# Altium schematic sheet OSC.SchDoc
size Letter; DrawnBy: Titan Yuan; SheetNumber: 7; SheetTotal: 9
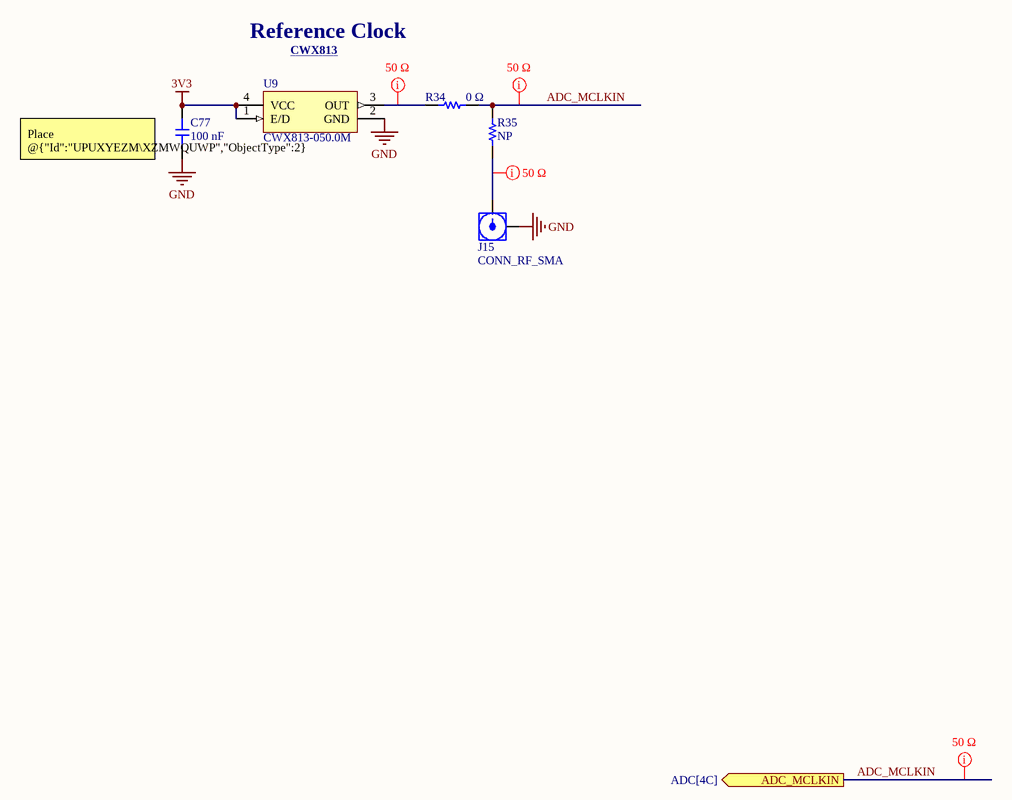
[diagram p0: OSC.SchDoc]

## Parts
C77  100 nF  [CAP_0402]
J15  CONN_RF_SMA  [142-0701-801]
R34  0 Ω  [RES_0402]
R35  NP  [RES_0402]
U9  CWX813-050.0M  [CWX8XX]

## Ports
ADC_MCLKIN (out, see ADC[4C])

## Nets
3V3: C77.2 U9.1(E/D) U9.4(VCC)
GND: C77.1 J15.2 U9.2(GND)
ADC_MCLKIN: R34.2 R35.2 ; port ADC_MCLKIN
NetJ15_1: J15.1 R35.1
NetR34_1: R34.1 U9.3(OUT)

## Layout directives
net class 50 Ω: ADC_MCLKIN, NetJ15_1, NetR34_1

## Notes on the sheet
- Reference Clock
- (near U9) CWX813 <https://www.conwin.com/datasheets/sm/sm111.pdf>
- (near C77) Place @{"Id":"UPUXYEZM\XZMWQUWP","ObjectType":2} right next to pin 2 of @{"Id":"UPUXYEZM\QIVNDBVN","ObjectType":2}.

## Library data of the parts
C77 = CAP: Ceramic Capacitor, Ceramic, 50V, 10% +Tol, 10% -Tol, X7R, 15% TC, 0.1uF, Surface Mount, 0402; Manufacturer: Yageo; Manufacturer Part Number: CC0402KPX7R9BB104; Tolerance: +-10%; Value: 100nF; Voltage Rating: 50 V; Dielectric: Ceramic; Package Size: 0402; Supplier: DigiKey; Supplier Part Number: 13-CC0402KPX7R9BB104CT-ND; RoHS: Compliant; Category: Ceramic Capacitors; Stock: 40680; Pricing: 1=0.1, 10=0.053, 50=0.0364, 100=0.0313, 500=0.02292, 1000=0.02035, 2500=0.01764, 5000=0.01601 (USD); Case/Package: 0402; China RoHS: Compliant; Dielectric Material: Ceramic; Height: 500µm; Lead Free: Lead Free; Length: 1mm; Lifecycle Status: Production; Max Operating Temperature: 125°C; Min Operating Temperature: -55°C; Mounting Technology: Surface Mount; Number of Terminals: 2; REACH SVHC: Yes; Voltage Rating (DC): 50V; Width: 500µm; ComponentLink1URL: https://datasheet.octopart.com:443/CC0402KPX7R9BB104-Yageo-datasheet-177165144.pdf?src-supplier=IHS; ComponentLink1Description: https://datasheet.octopart.com:443/CC0402KPX7R9BB104-Yageo-datasheet-177165144.pdf?src-supplier=IHS; ComponentLink2URL: https://datasheet.octopart.com:443/CC0402KPX7R9BB104-Yageo-Group-datasheet-189192896.pdf?src-supplier=Future+Electronics; ComponentLink2Description: https://datasheet.octopart.com:443/CC0402KPX7R9BB104-Yageo-Group-datasheet-189192896.pdf?src-supplier=Future+Electronics; ComponentLink3URL: https://datasheet.octopart.com:443/CC0402KPX7R9BB104-Yageo-datasheet-181967134.pdf?src-supplier=Farnell; ComponentLink3Description: https://datasheet.octopart.com:443/CC0402KPX7R9BB104-Yageo-datasheet-181967134.pdf?src-supplier=Farnell; ComponentLink4URL: https://datasheet.octopart.com/Surface-Mount-Ceramic-Multilayer-Capacitors%3B-General-Purpose-%26-High-Capacitance-Class-2%2C-X7R-Yageo-datasheet-family-114.pdf; ComponentLink4Description: https://datasheet.octopart.com/Surface-Mount-Ceramic-Multilayer-Capacitors%3B-General-Purpose-%26-High-Capacitance-Class-2%2C-X7R-Yageo-datasheet-family-114.pdf; ComponentLink5URL: https://datasheet.octopart.com/CC0402KPX7R9BB104-Yageo-datasheet-10883670.pdf; ComponentLink5Description: https://datasheet.octopart.com/CC0402KPX7R9BB104-Yageo-datasheet-10883670.pdf; ComponentLink6URL: http://sigma.octopart.com:80/rohs_statement/Surface-Mount-Ceramic-Multilayer-Capacitors%3B-General-Purpose-%26-High-Capacitance-Class-2%2C-X7R-Yageo-family-124.pdf?src-supplier=Compliance+Statements; ComponentLink6Description: http://sigma.octopart.com:80/rohs_statement/Surface-Mount-Ceramic-Multilayer-Capacitors%3B-General-Purpose-%26-High-Capacitance-Class-2%2C-X7R-Yageo-family-124.pdf?src-supplier=Compliance+Statements; ComponentLink7URL: http://sigma.octopart.com:80/reach_statement/Surface-Mount-Ceramic-Multilayer-Capacitors%3B-General-Purpose-%26-High-Capacitance-Class-2%2C-X7R-Yageo-family-125.pdf?src-supplier=Compliance+Statements; ComponentLink7Description: http://sigma.octopart.com:80/reach_statement/Surface-Mount-Ceramic-Multilayer-Capacitors%3B-General-Purpose-%26-High-Capacitance-Class-2%2C-X7R-Yageo-family-125.pdf?src-supplier=Compliance+Statements; ComponentLink8URL: http://sigma.octopart.com:80/conflict_mineral_statement/Yageo-company-3.pdf?src-supplier=Compliance+Statements; ComponentLink8Description: http://sigma.octopart.com:80/conflict_mineral_statement/Yageo-company-3.pdf?src-supplier=Compliance+Statements; ComponentLink9URL: http://sigma.octopart.com:80/rohs_statement/Yageo-company-2.pdf?src-supplier=Compliance+Statements; ComponentLink9Description: http://sigma.octopart.com:80/rohs_statement/Yageo-company-2.pdf?src-supplier=Compliance+Statements
J15 = CONN_RF_SMA: RF / Coaxial Connector, SMA Coaxial, Straight Jack, Solder, 50 ohm, Beryllium Copper; Manufacturer: Cinch Connectivity Solutions Johnson; Maximum Frequency: 18 GHz; Body Material: Brass; Body Plating: Gold; Connector Type: Coaxial, PCB, SMA, Socket; Contact Resistance: 4mΩ; Dielectric Material: PTFE; Frequency: 18GHz; Gender: Female; Impedance: 50Ω; Insulation Resistance: 5GΩ; Number of Contacts: 1; Polarity: Normal; Voltage Rating: 335V; Manufacturer Part Number: 142-0701-801; Supplier: DigiKey; Supplier Part Number: J502-ND; RoHS: Compliant; Category: RF / Coaxial Connectors; Stock: 35108; Pricing: 1=3.73, 10=3.166, 25=2.9676, 50=2.826, 100=2.691, 250=2.52244, 500=2.40206, 1000=2.28748, 2500=2.1444 (USD); Case/Package: SMA; Contact Gender: Female; Contact Material: Gold, Nickel; Contact Plating: Gold; Depth: 25.58mm; Export Control Classification Number (ECCN) Code: EAR99; Fastening Type: Threaded; Height: 9.779mm; Housing Color: Gold; Housing Material: Brass; Harmonized Tariff Schedule (HTS) Code: 8536.69.40.10; Insulation Material: PTFE; Introduction Date: 1994-06-01; Lead Free: Lead Free; Length: 9.52mm; Lifecycle Status: Production; Clock Frequency: 18GHz; Max Operating Temperature: 165°C; Min Operating Temperature: -65°C; Mounting Technology: Edge, PCB; Pins: 1; Number of Ports: 1; Orientation: Straight; Radiation Hardening: No; REACH SVHC: No; Schedule B: 8536695050, 8536695050|8536695050|8536695050|8536695050|8536695050; Shell Material: Brass; Termination: Solder; ComponentLink1URL: https://datasheet.octopart.com:443/142-0701-801-Cinch-Connectors-datasheet-38159423.pdf?src-supplier=element14+APAC; ComponentLink1Description: https://datasheet.octopart.com:443/142-0701-801-Cinch-Connectors-datasheet-38159423.pdf?src-supplier=element14+APAC; ComponentLink2URL: https://datasheet.octopart.com:443/142-0701-801-Cinch-Connectivity-Solutions-datasheet-128878268.pdf?src-supplier=JRH+Electronics; ComponentLink2Description: https://datasheet.octopart.com:443/142-0701-801-Cinch-Connectivity-Solutions-datasheet-128878268.pdf?src-supplier=JRH+Electronics; ComponentLink3URL: https://datasheet.octopart.com:443/142-0701-801-Cinch-Connectivity-Solutions-datasheet-180501451.pdf?src-supplier=IHS; ComponentLink3Description: https://datasheet.octopart.com:443/142-0701-801-Cinch-Connectivity-Solutions-datasheet-180501451.pdf?src-supplier=IHS; ComponentLink4URL: https://datasheet.octopart.com:443/142-0701-801-Cinch-Connectivity-Solutions-datasheet-182240672.pdf?src-supplier=IHS; ComponentLink4Description: https://datasheet.octopart.com:443/142-0701-801-Cinch-Connectivity-Solutions-datasheet-182240672.pdf?src-supplier=IHS; ComponentLink5URL: https://datasheet.octopart.com:443/142-0701-801-Emerson-datasheet-182246267.pdf?src-supplier=IHS; ComponentLink5Description: https://datasheet.octopart.com:443/142-0701-801-Emerson-datasheet-182246267.pdf?src-supplier=IHS; ComponentLink6URL: https://datasheet.octopart.com:443/142-0701-801-Emerson-Network-Power-datasheet-40124.pdf?src-supplier=Newark; ComponentLink6Description: https://datasheet.octopart.com:443/142-0701-801-Emerson-Network-Power-datasheet-40124.pdf?src-supplier=Newark; ComponentLink7URL: https://datasheet.octopart.com:443/142-0701-801-Cinch-Connectors-datasheet-24914353.pdf?src-supplier=Electro+Sonic; ComponentLink7Description: https://datasheet.octopart.com:443/142-0701-801-Cinch-Connectors-datasheet-24914353.pdf?src-supplier=Electro+Sonic; ComponentLink8URL: https://datasheet.octopart.com:443/142-0701-801-Emerson-Network-Power-datasheet-14433785.pdf?src-supplier=Farnell; ComponentLink8Description: https://datasheet.octopart.com:443/142-0701-801-Emerson-Network-Power-datasheet-14433785.pdf?src-supplier=Farnell; ComponentLink9URL: https://datasheet.octopart.com:443/142-0701-801-Emerson-Network-Power-datasheet-8828422.pdf?src-supplier=Farnell; ComponentLink9Description: https://datasheet.octopart.com:443/142-0701-801-Emerson-Network-Power-datasheet-8828422.pdf?src-supplier=Farnell; ComponentLink10URL: https://datasheet.octopart.com:443/142-0701-801-Emerson-Network-Power-datasheet-10031126.pdf?src-supplier=Farnell; ComponentLink10Description: https://datasheet.octopart.com:443/142-0701-801-Emerson-Network-Power-datasheet-10031126.pdf?src-supplier=Farnell; ComponentLink11URL: https://datasheet.octopart.com:443/142-0701-801-Emerson-Network-Power-datasheet-47159.pdf?src-supplier=Farnell; ComponentLink11Description: https://datasheet.octopart.com:443/142-0701-801-Emerson-Network-Power-datasheet-47159.pdf?src-supplier=Farnell; ComponentLink12URL: https://datasheet.octopart.com:443/142-0701-801-Emerson-Network-Power-datasheet-29036.pdf?src-supplier=Farnell; ComponentLink12Description: https://datasheet.octopart.com:443/142-0701-801-Emerson-Network-Power-datasheet-29036.pdf?src-supplier=Farnell; ComponentLink13URL: https://datasheet.octopart.com:443/142-0701-801-Semflex-datasheet-33021794.pdf?src-supplier=East+Coast+Microwave; ComponentLink13Description: https://datasheet.octopart.com:443/142-0701-801-Semflex-datasheet-33021794.pdf?src-supplier=East+Coast+Microwave; ComponentLink14URL: https://datasheet.octopart.com:443/142-0701-801-Emerson-datasheet-31818286.pdf?src-supplier=East+Coast+Microwave; ComponentLink14Description: https://datasheet.octopart.com:443/142-0701-801-Emerson-datasheet-31818286.pdf?src-supplier=East+Coast+Microwave; ComponentLink15URL: https://datasheet.octopart.com:443/142-0701-801-Cinch-Connectors-datasheet-27682.pdf?src-supplier=RS+(Formerly+Allied+Electronics); ComponentLink15Description: https://datasheet.octopart.com:443/142-0701-801-Cinch-Connectors-datasheet-27682.pdf?src-supplier=RS+(Formerly+Allied+Electronics); ComponentLink16URL: https://datasheet.octopart.com:443/142-0701-801-Emerson-Network-Power-datasheet-644257.pdf?src-supplier=Future+Electronics; ComponentLink16Description: https://datasheet.octopart.com:443/142-0701-801-Emerson-Network-Power-datasheet-644257.pdf?src-supplier=Future+Electronics; ComponentLink17URL: https://datasheet.octopart.com:443/142-0701-801-Emerson-Network-Power-datasheet-55164.pdf?src-supplier=_legacy+Avnet; ComponentLink17Description: https://datasheet.octopart.com:443/142-0701-801-Emerson-Network-Power-datasheet-55164.pdf?src-supplier=_legacy+Avnet
R34 = RES: GENERAL PURPOSE CHIP RESISTOR Metal Glaze/thick Film, 0.0625W, 0ohm, Surface Mount, 0402; Manufacturer: Yageo; Manufacturer Part Number: RC0402FR-070RL; Power Rating: 1/16 W; Power Dissipation: 62.5mW; Value: 0Ω; Voltage Rating: 50V; Tolerance: *; Package Size: 0402; Supplier: DigiKey; Supplier Part Number: 311-0.0LRCT-ND; RoHS: Compliant; Category: Chip SMD Resistors; Stock: 6847013; Pricing: 1=0.1, 10=0.010, 25=0.0064, 50=0.0054, 100=0.0047, 250=0.00392, 500=0.00346, 1000=0.00304, 5000=0.0023 (USD); Case/Package: 0402; Case Code (Imperial): 0402; Case Code (Metric): 1005; China RoHS: Non-Compliant; Composition: Thick Film; Contact Plating: Tin; Country of Origin: Mainland China, Taiwan; Export Control Classification Number (ECCN) Code: EAR99; Height: 350µm; Harmonized Tariff Schedule (HTS) Code: 8533.21.00.30; Introduction Date: 2004-09-22; Lead Free: Lead Free; Length: 1mm; Lifecycle Status: Production; Max Operating Temperature: 155°C; Min Operating Temperature: -55°C; Mounting Technology: Surface Mount; Number of Terminals: 2; Packaging: Tape & Reel; Radiation Hardening: No; REACH SVHC: Yes; Termination: SMD/SMT; Width: 500µm; ComponentLink1URL: https://datasheet.octopart.com:443/RC0402FR-070RL-Yageo-datasheet-141265859.pdf?src-supplier=Upverter; ComponentLink1Description: https://datasheet.octopart.com:443/RC0402FR-070RL-Yageo-datasheet-141265859.pdf?src-supplier=Upverter; ComponentLink2URL: https://sigma.octopart.com:443/138820526/technical_drawing/Yageo-RC0402FR-070RL.pdf?src-supplier=Upverter; ComponentLink2Description: https://sigma.octopart.com:443/138820526/technical_drawing/Yageo-RC0402FR-070RL.pdf?src-supplier=Upverter; ComponentLink3URL: https://datasheet.octopart.com:443/RC0402FR-070RL-Yageo-datasheet-12531192.pdf?src-supplier=IHS; ComponentLink3Description: https://datasheet.octopart.com:443/RC0402FR-070RL-Yageo-datasheet-12531192.pdf?src-supplier=IHS; ComponentLink4URL: https://datasheet.octopart.com:443/RC0402FR-070RL-Yageo-Group-datasheet-176638170.pdf?src-supplier=Future+Electronics; ComponentLink4Description: https://datasheet.octopart.com:443/RC0402FR-070RL-Yageo-Group-datasheet-176638170.pdf?src-supplier=Future+Electronics; ComponentLink5URL: https://datasheet.octopart.com:443/RC0402FR-070RL-Yageo-datasheet-164759695.pdf?src-supplier=Future+Electronics; ComponentLink5Description: https://datasheet.octopart.com:443/RC0402FR-070RL-Yageo-datasheet-164759695.pdf?src-supplier=Future+Electronics; ComponentLink6URL: https://datasheet.octopart.com:443/RC0402FR-070RL-Yageo-datasheet-137700087.pdf?src-supplier=Future+Electronics; ComponentLink6Description: https://datasheet.octopart.com:443/RC0402FR-070RL-Yageo-datasheet-137700087.pdf?src-supplier=Future+Electronics; ComponentLink7URL: https://datasheet.octopart.com:443/RC0402FR-070RL-Yageo-datasheet-10408619.pdf?src-supplier=Future+Electronics; ComponentLink7Description: https://datasheet.octopart.com:443/RC0402FR-070RL-Yageo-datasheet-10408619.pdf?src-supplier=Future+Electronics; ComponentLink8URL: https://datasheet.octopart.com:443/RC0402FR-070RL-Yageo-datasheet-8324527.pdf?src-supplier=Future+Electronics; ComponentLink8Description: https://datasheet.octopart.com:443/RC0402FR-070RL-Yageo-datasheet-8324527.pdf?src-supplier=Future+Electronics; ComponentLink9URL: https://datasheet.octopart.com:443/RC0402FR-070RL-Yageo-datasheet-79472498.pdf?src-supplier=Megastar; ComponentLink9Description: https://datasheet.octopart.com:443/RC0402FR-070RL-Yageo-datasheet-79472498.pdf?src-supplier=Megastar; ComponentLink10URL: https://datasheet.octopart.com/RC0402FR-070RL-Yageo-datasheet-73766026.pdf; ComponentLink10Description: https://datasheet.octopart.com/RC0402FR-070RL-Yageo-datasheet-73766026.pdf; ComponentLink11URL: http://sigma.octopart.com:80/conflict_mineral_statement/Yageo-company-3.pdf?src-supplier=Compliance+Statements; ComponentLink11Description: http://sigma.octopart.com:80/conflict_mineral_statement/Yageo-company-3.pdf?src-supplier=Compliance+Statements; ComponentLink12URL: http://sigma.octopart.com:80/rohs_statement/Yageo-company-2.pdf?src-supplier=Compliance+Statements; ComponentLink12Description: http://sigma.octopart.com:80/rohs_statement/Yageo-company-2.pdf?src-supplier=Compliance+Statements
R35 = RES: Resistor SMD Generic; Manufacturer: *; Manufacturer Part Number: *; Tolerance: *; Power Rating: *; Package Size: 0402
U9 = CWX813-050.0M: LVCMOS Output Clock Oscillator, 50MHz Nom; Manufacturer: Connor-Winfield; Frequency Stability: +-25 ppm; Supply Voltage: 3.3 V; Body Material: Ceramic; Fall Time: 6ns; Load Capacitance: 15pF; Max Supply Current: 30mA; Max Supply Voltage: 3.465V; Min Supply Voltage: 3.135V; Operating Supply Voltage: 3.3V; Manufacturer Part Number: CWX813-050.0M; Frequency: 50 MHz; Temperature Range: -20C to 70C; Supplier: DigiKey; Supplier Part Number: CW541CT-ND; RoHS: Compliant; Category: Oscillators; Stock: 2464; Pricing: 1=4.46, 10=3.878, 25=3.6668, 50=3.5152, 100=3.37, 250=3.28952 (USD); Case/Package: SMD/SMT; Height: 1.2954mm; Lead Free: Lead Free; Length: 7.0104mm; Lifecycle Status: Production; Max Operating Temperature: 70°C; Min Operating Temperature: -20°C; Mounting Technology: Surface Mount; Nominal Supply Current: 30mA; Number of Terminals: 4; Output Type: LVCMOS; REACH SVHC: Yes; Rise Time: 6ns; Width: 5.0038mm; ComponentLink1URL: https://datasheet.octopart.com:443/CWX813-050.0M-Connor-Winfield-datasheet-14434119.pdf?src-supplier=IHS; ComponentLink1Description: https://datasheet.octopart.com:443/CWX813-050.0M-Connor-Winfield-datasheet-14434119.pdf?src-supplier=IHS